# EAGLE design MasterBetaKit-v2-simple (EAGLE 7.1.0)
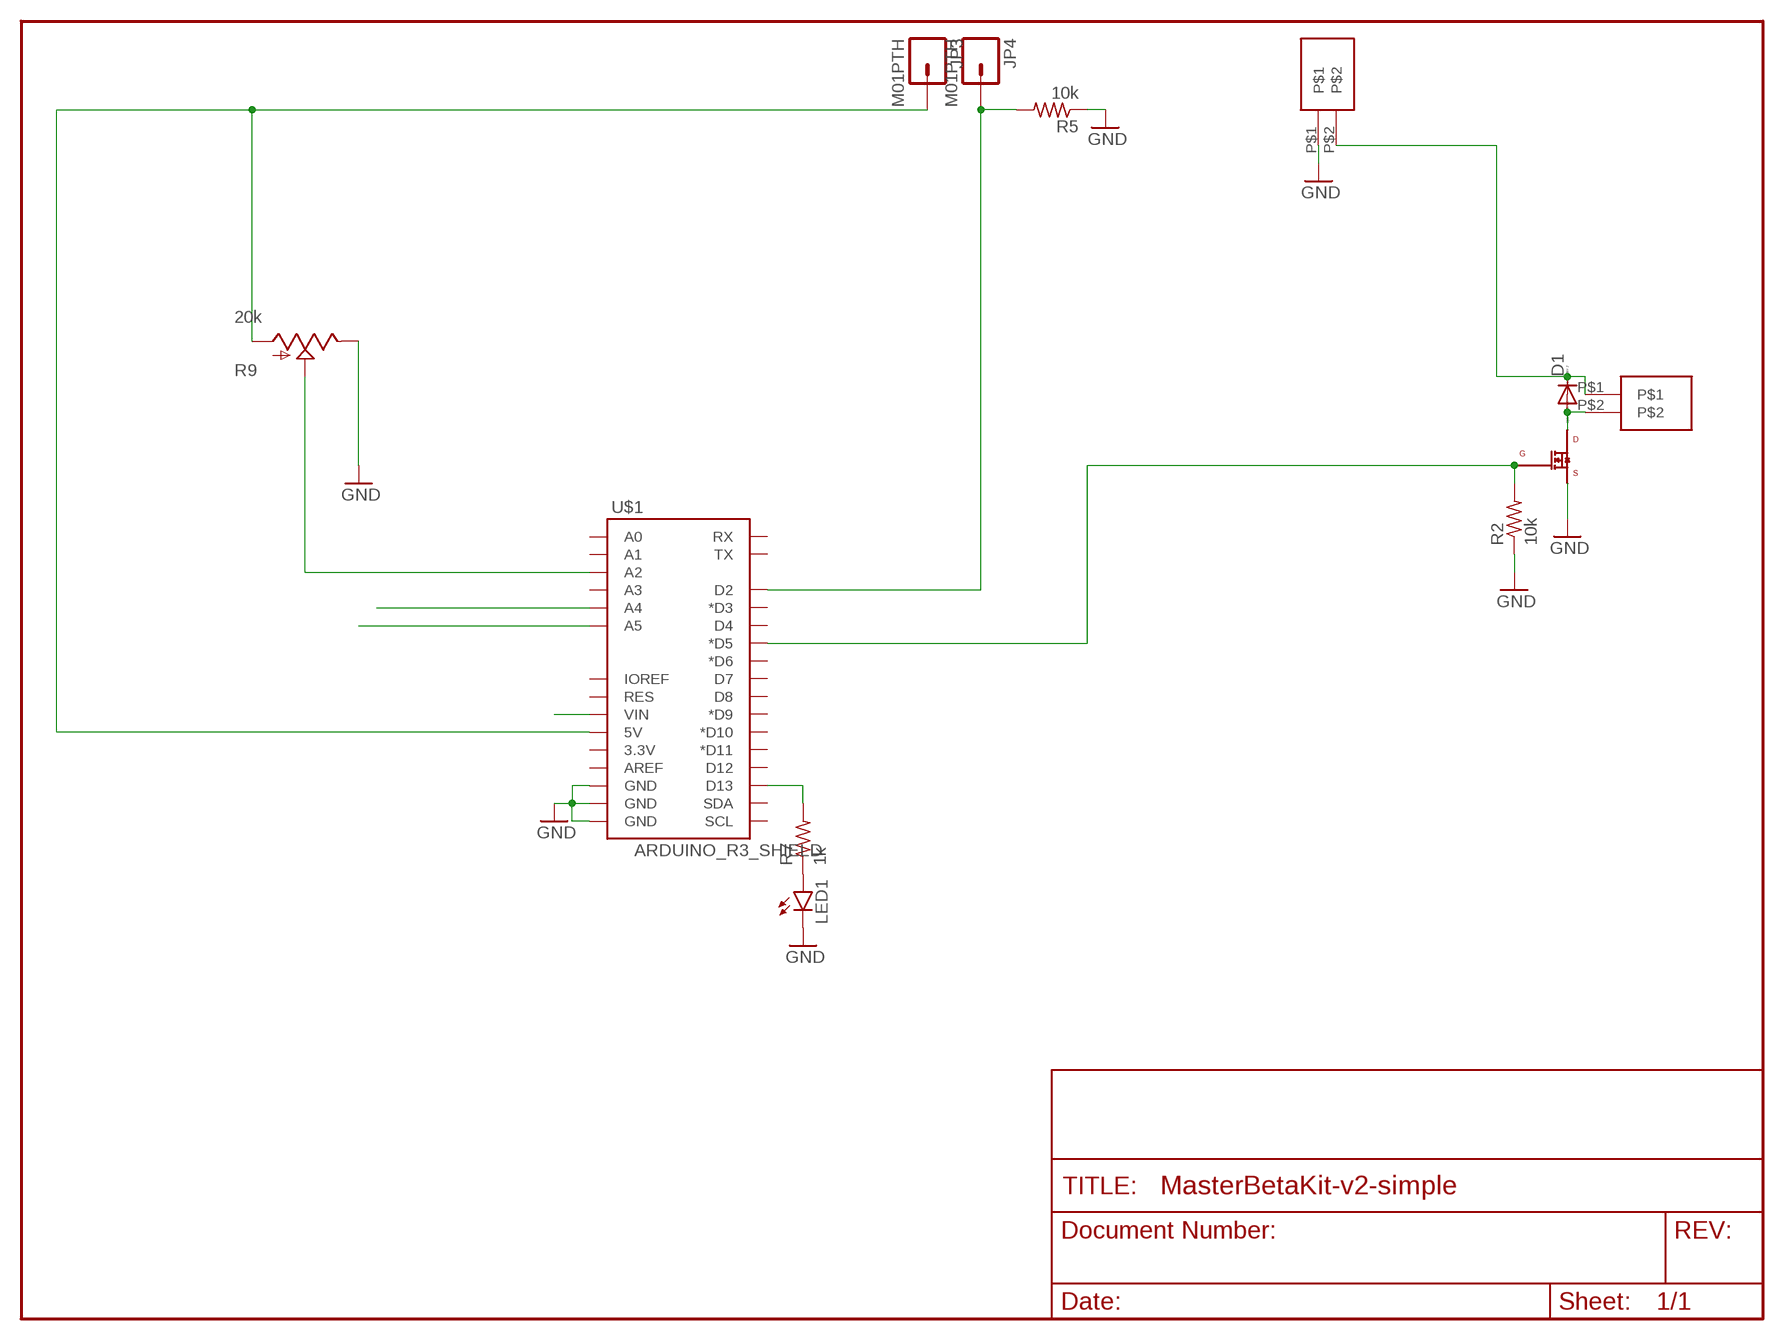
[diagram p0: schematic, sheet 1]

## Parts
D1  DIODE-DO-214AC  [DO-214AC]
JP3  M01PTH  [1X01]
JP4  M01PTH  [1X01]
LED1  LED-3MM-NO_SILK  [LED3MM-NS]
R2  10k  R-US_R0603  [R0603]
R5  10k  R-US_R0603  [R0603]
R7  1k  R-US_R0603  [R0603]
R9  20k  POTALPS-KIT  [ALPS_POT_KIT]
U$1  ARDUINO_R3_SHIELD  [UNO_R3_SHIELD]
U$2  IRLML0060  [SOT-23]
U$6  SPRING-TERMINAL  [SPRING-TERMINAL]
X3  SPRING-TERMINAL  [SPRING-TERMINAL]

## Nets
5V: JP3.1 R9.P$3(A) U$1.5V
BUTTON: JP4.1 R5.2 U$1.D2
CL: U$1.A5
DA: U$1.A4
GND: LED1.K(C) R2.1 R5.1 R9.P$1(E) U$1.GND@0(GND) U$1.GND@1(GND) U$1.GND@2(GND) U$2.2(SOURCE) X3.P$1
N$1: R2.2 U$1.D5(*D5) U$2.1(GATE)
N$8: D1.A U$2.3(DRAIN) U$6.P$2
N$26: LED1.A R7.1
N$27: R7.2 U$1.D13
N$28: R9.P$2(S) U$1.A2
N$29: U$1.VIN
X4 [vcc]: D1.C U$6.P$1 X3.P$2
Unconnected: U$1.3.3V U$1.A0 U$1.A1 U$1.A3 U$1.AREF U$1.D3(*D3) U$1.D4 U$1.D6(*D6) U$1.D7 U$1.D8 U$1.D9(*D9) U$1.D10(*D10) U$1.D11(*D11) U$1.D12 U$1.IOREF U$1.RES U$1.RX U$1.SCL U$1.SDA U$1.TX

## Library data of the parts
D1 = diode:DIODE-: DIODE
JP3 JP4 = SparkFun-Connectors:M01: Header 1 Standard 1-pin 0.1" header. Use with straight break away headers (SKU : PRT-00116), right angle break away headers (PRT-00553), swiss pins (PRT-00743), machine pins (PRT-00117), and female headers (PRT-00115).
LED1 = SparkFun-LED:LED: LEDs Standard schematic elements and footprints for 5mm, 3mm, 1206, and 0603 sized LEDs. 5mm - Spark Fun Electronics SKU : COM-00529 (and others)
R2 R5 R7 = resistor:R-US_: RESISTOR, American symbol
R9 = SparkFun-Electromechanical:POT
U$1 = SparkFun-Boards:ARDUINO_R3_SHIELD: Shield form compatible with the Arduino Uno R3.
U$2 = spietz-library:IRLML0060
U$6 X3 = spietz-library:SPRING-TERMINAL

## Net classes
0 default: width 0.203 mm
1 vcc: width 0.254 mm

## Board
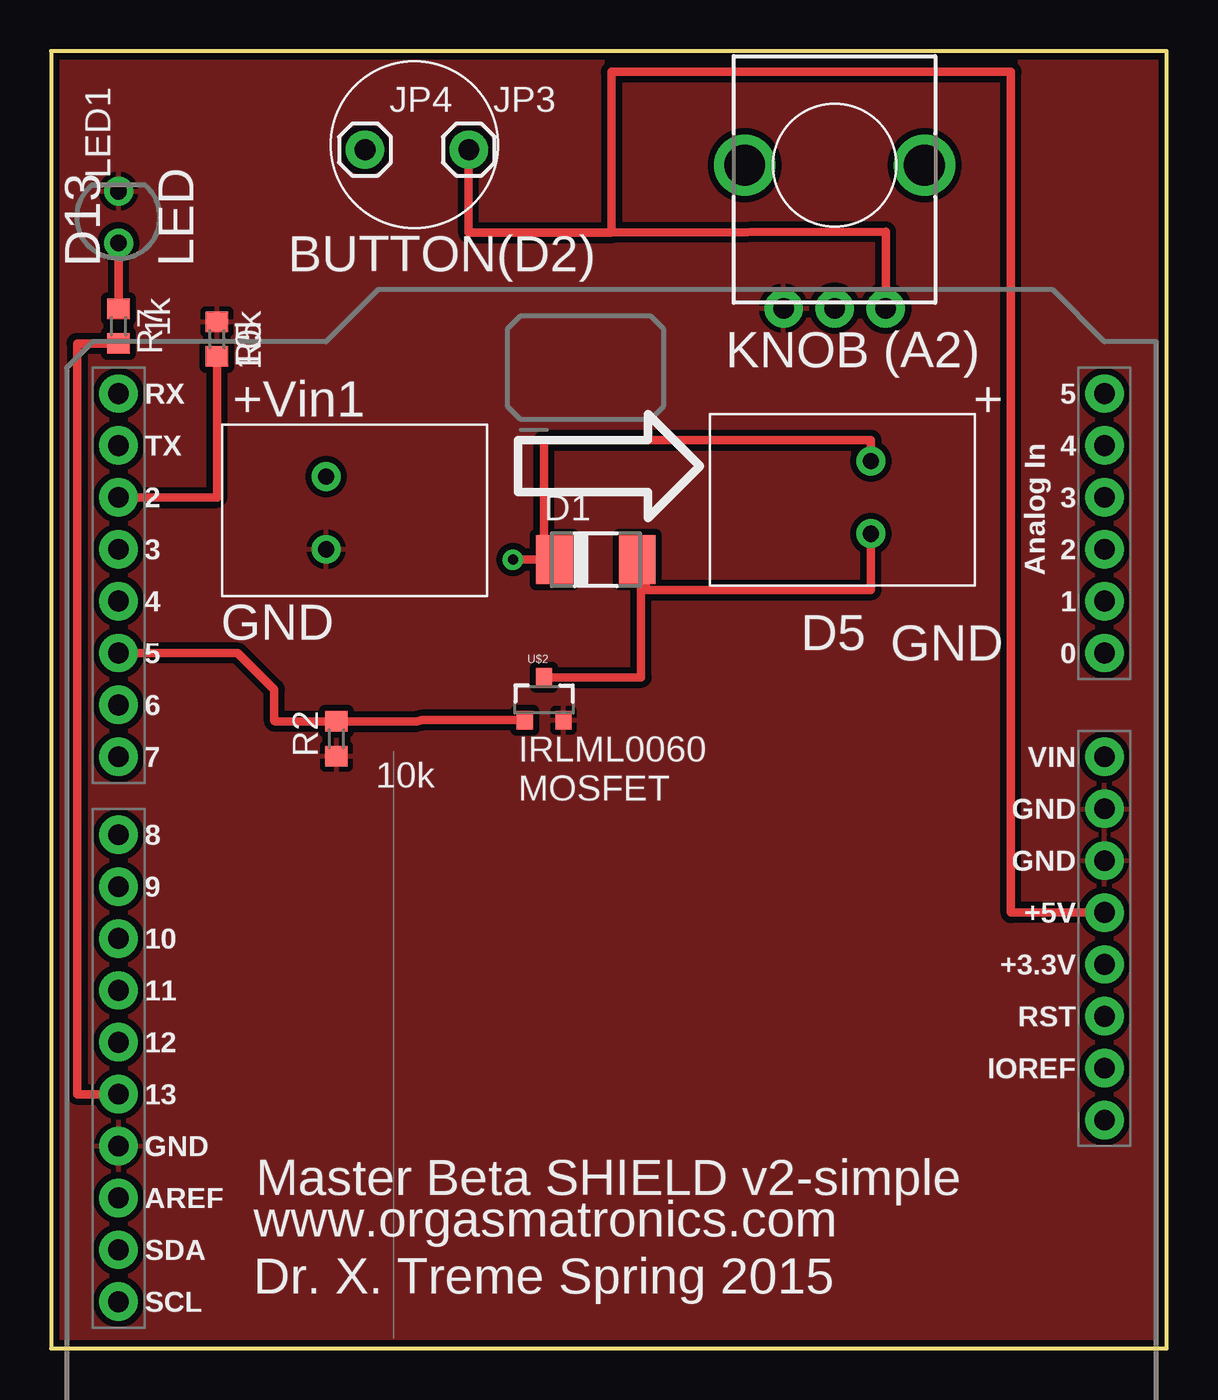
[diagram p1: board, top side]
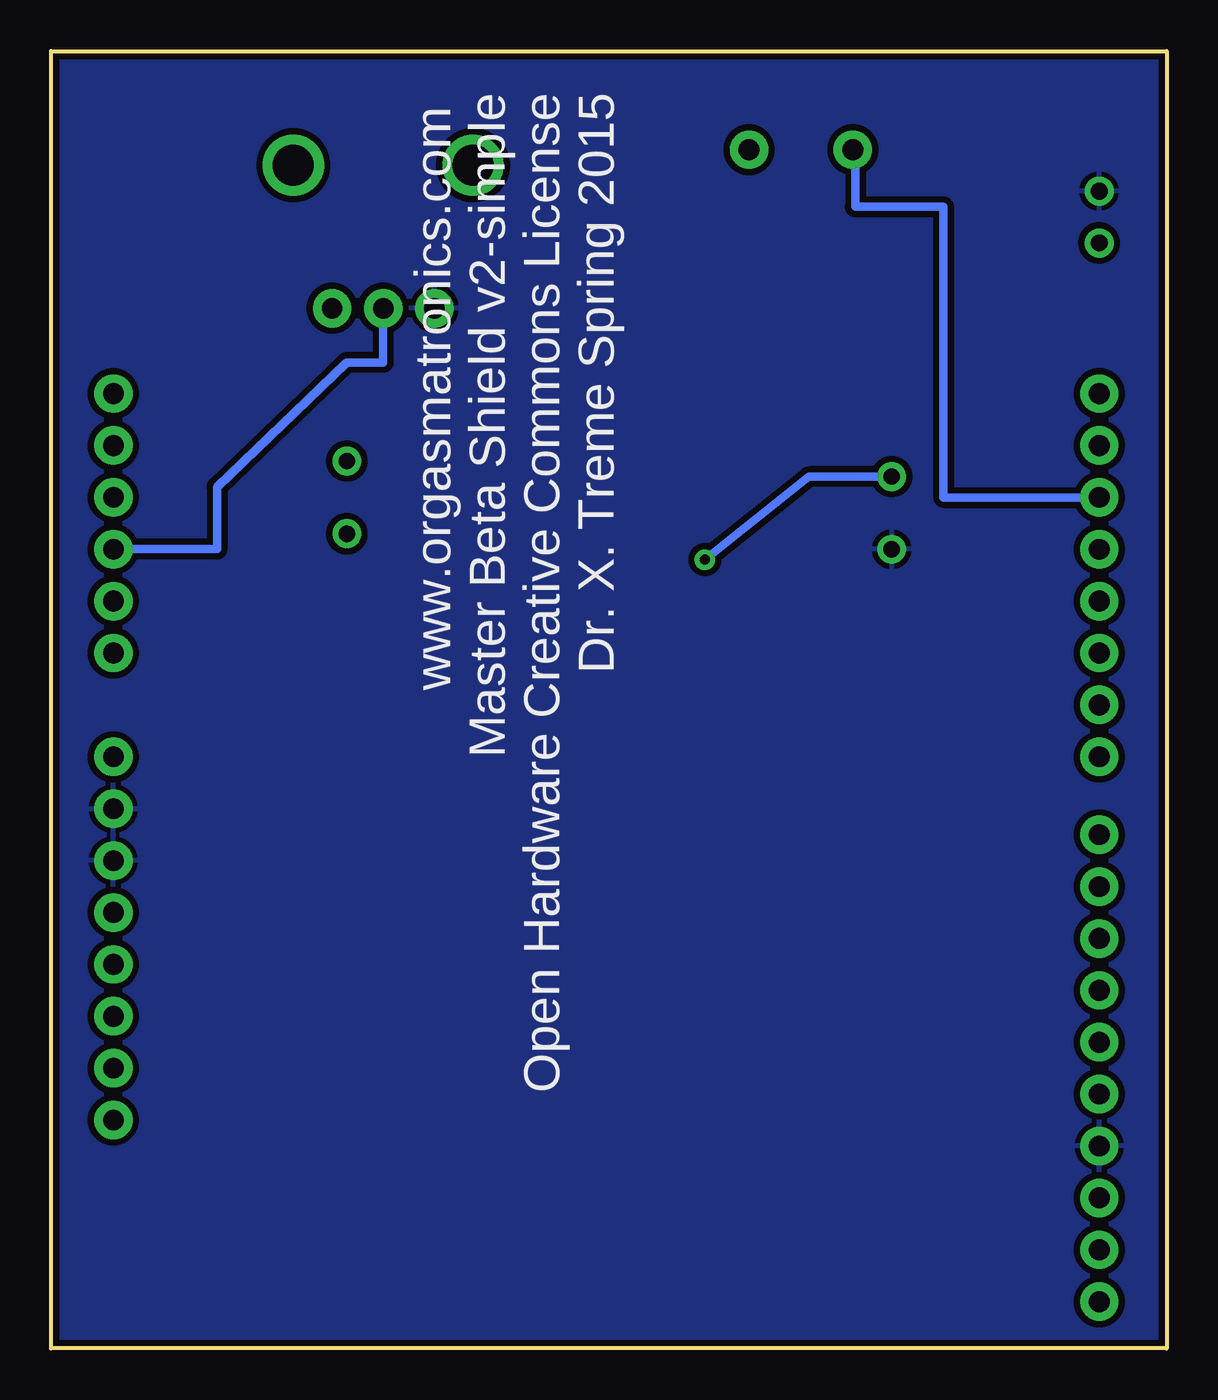
[diagram p2: board, bottom side, seen from below]

Size 54.61 x 63.5 mm. Coordinates in mm from the lower left corner, seen from the top.
Outline: 0,63.5 0,0 54.61,0 54.61,63.5 0,63.5
Copper layers (1*16): Top 0.035mm / dielectric 1.5mm / Bottom 0.035mm
Design rules "default": minimum track width 8mil, minimum drill 20mil, track to track 8mil, track to pad 8mil, pad to pad 8mil, via to via 8mil, smd to smd 8mil, copper to edge 10mil, drill to drill 8mil, minimum pad ring 12mil, minimum via ring 10mil, stop-mask expansion 4mil, vias tented up to drill 25mil, thermal gap 10mil

### Footprints (pad centres in the part's own frame; a part is rotated, then mirrored left to right if it is on the bottom)
DO-214AC = smd 1.8 x 2.4: A 2.025,0; C -2.025,0
1X01 = drill 1.016 pad 1.88: 1 0,0
LED3MM-NS = drill 0.813: A -1.27,0; K 1.27,0
R0603 = smd 1 x 1.1: 1 -0.85,0; 2 0.85,0
ALPS_POT_KIT = drill 1 pad 1.88: P$1 7,-2.5; P$2 7,0; P$3 7,2.5 | drill 2: P$4 0,-4.4; P$5 0,4.4
UNO_R3_SHIELD = drill 1.016 pad 1.88: 3.3V 50.8,26.67; 5V 50.8,29.21; A0 50.8,41.91; A1 50.8,44.45; A2 50.8,46.99; A3 50.8,49.53; A4 50.8,52.07; A5 50.8,54.61; AREF 2.54,15.24; D2 2.54,49.53; D3 2.54,46.99; D4 2.54,44.45; D5 2.54,41.91; D6 2.54,39.37; D7 2.54,36.83; D8 2.54,33.02; D9 2.54,30.48; D10 2.54,27.94; D11 2.54,25.4; D12 2.54,22.86; D13 2.54,20.32; GND@0 50.8,31.75; GND@1 50.8,34.29; GND@2 2.54,17.78; IOREF 50.8,21.59; NC 50.8,19.05; RES 50.8,24.13; RX 2.54,54.61; SCL 2.54,10.16; SDA 2.54,12.7; TX 2.54,52.07; VIN 50.8,36.83
SOT-23 = smd 0.8 x 0.9: 1 -0.95,-1; 2 0.95,-1; 3 0,1.1
SPRING-TERMINAL = drill 0.8: P$1 5.08,1.778; P$2 5.08,5.334

### Placement (x,y rotation side)
D1  26.67,38.61 0 top
JP3  20.45,58.67 0 top
JP4  15.37,58.67 0 top
LED1  3.3,55.37 90 top
R2  13.97,29.84 90 top
R5  8.13,49.4 270 top
R7  3.3,50.04 270 top
R9  38.35,57.91 270 top
U$1  0.76,-7.87 0 top
U$2  24.13,31.75 0 top
U$6  45.21,45.21 180 top
X3  8.38,37.34 0 top

### Tracks (layer width: path | path; a pad name or v marks a point on that pad's centre or on a via)
5V
  Top 0.406: 27.43,54.61 20.45,54.61 JP3.1 | 27.43,54.61 27.43,62.48 46.99,62.48 46.99,21.34 U$1.5V | R9.P$3 40.85,54.65 27.43,54.61
BUTTON
  Top 0.406: U$1.D2 8.13,41.66 R5.2
  Bottom 0.406: JP4.1 15.24,57.66 15.24,55.88 10.92,55.88 10.92,41.66 U$1.D2
GND
  pour Top (isolate 0.305): 0,63.5 77.47,63.5 77.47,0 0,0
  pour Bottom (isolate 0.305): 0,63.5 72.39,63.5 72.39,0 0,0
N$1
  Top 0.406: U$1.D5 9.14,34.04 10.92,32.26 10.92,30.73 10.96,30.7 R2.2 17.91,30.7 18.16,30.75 U$2.1
N$8
  Top 0.406: 28.89,38 29.16,37.13 40.13,37.13 U$6.P$2 | 28.89,38 D1.A | U$2.3 28.89,32.85 28.89,38
N$26
  Top 0.406: R7.1 LED1.A
N$27
  Top 0.406: R7.2 1.27,49.19 1.27,12.45 U$1.D13
N$28
  Bottom 0.406: R9.P$2 38.35,48.26 40.13,48.26 46.48,42.16 46.48,39.12 U$1.A2
X4  (via drill 0.5)
  Top 0.406: v22.61,38.61 D1.C 24.13,38.61 24.13,44.45 40.13,44.45 U$6.P$1
  Bottom 0.406: X3.P$2 17.53,42.67 v22.61,38.61

### Text on the board
tPlace: D13 | LED | BUTTON(D2) | 1k | 10k | KNOB (A2) | +Vin1 | + | GND | GND | D5 | 10k | IRLML0060 / MOSFET | Master Beta SHIELD v2-simple | www.orgasmatronics.com | Dr. X. Treme Spring 2015
bPlace: www.orgasmatronics.com / Master Beta Shield v2-simple / Open Hardware Creative Commons License / Dr. X. Treme Spring 2015
tValues: Tent Vias! | Arduino Wee v1.3